# Altium schematic sheet Timer.SchDoc
size A4; SheetNumber: 5; SheetTotal: 21
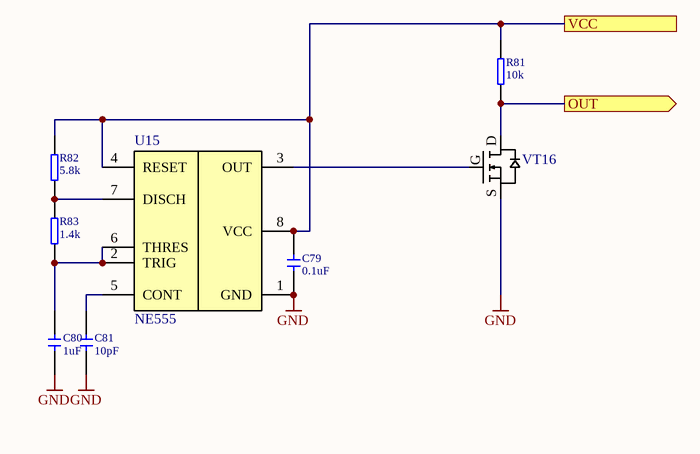
[diagram p0: Timer.SchDoc]

## Parts
C79  value 0.1uF  [CERCAP 0402]
C80  value 1uF  [CERCAP 0603]
C81  value 10pF  [CERCAP 0402]
R81  value 10k  [RES 0402]
R82  value 5.8k  [RES 0402]
R83  value 1.4k  [RES 0402]
U15  NE555  [SO-8]
VT16  2N7002  [SOT23-3]  (value not drawn)

## Ports
OUT (out), VCC

## Nets
GND: C79.1 C80.1 C81.1 U15.1(GND) VT16.S1
OUT: R81.1 VT16.D6 ; port OUT
VCC: C79.2 R81.2 R82.2 U15.4(RESET) U15.8(VCC) ; port VCC
NetC80_2: C80.2 R83.1 U15.2(TRIG) U15.6(THRES)
NetC81_2: C81.2 U15.5(CONT)
NetR82_1: R82.1 R83.2 U15.7(DISCH)
NetU15_3: U15.3(OUT) VT16.G2

## Notes on the sheet
- (in symbol !Generic N MOSFET) D; G; S

## Library data of the parts
C79-C81 = !Capacitor: Capacitor; IsSMT: NoSMT; Voltage: 50V; Diel: X7R
R81-R83 = !Resistor: Resistor; IsSMT: NoSMT
U15 = NE555: 555 timer
VT16 = !Generic N MOSFET: generic N mosfet; pin to pad: D6>3 G2>1 S1>2; IsSMT: NoSMT